# Altium schematic sheet power.SchDoc
size A4
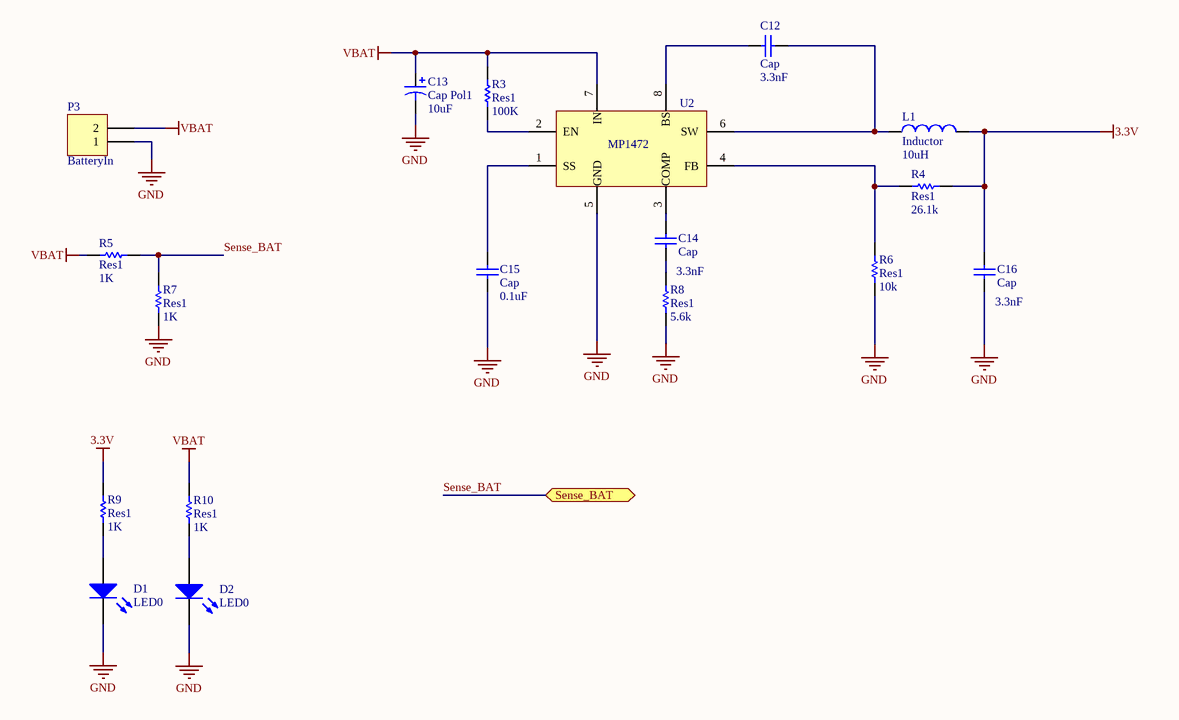
[diagram p0: power.SchDoc]

## Parts
C12  Cap  value 3.3nF  [0805-CAP]
C13  Cap Pol1  value 10uF  [Tantalum A-Case]
C14  Cap  value 3.3nF  [0805-CAP]
C15  Cap  value 0.1uF  [0805-CAP]
C16  Cap  value 3.3nF  [0805-CAP]
D1  LED0  [1206-LED RED]
D2  LED0  [1206-LED RED]
L1  Inductor  value 10uH  [DR125]
P3  BatteryIn  [Battery 1]
R3  Res1  value 100K  [0805-RES]
R4  Res1  value 26.1k  [0805-RES]
R5  Res1  value 1K  [0805-RES]
R6  Res1  value 10k  [0805-RES]
R7  Res1  value 1K  [0805-RES]
R8  Res1  value 5.6k  [0805-RES]
R9  Res1  value 1K  [0805-RES]
R10  Res1  value 1K  [0805-RES]
U2  MP1472  [TSOP-23]

## Ports
Sense_BAT

## Nets
3.3V: C16.1 L1.2 R4.2 R9.2
GND: C13.2 C15.2 C16.2 D1.2(K) D2.2(K) P3.1 R6.1 R7.2 R8.2 U2.5(GND)
VBAT: C13.1 P3.2 R3.1 R5.1 R10.2 U2.7(IN)
Sense_BAT: R5.2 R7.1 ; port Sense_BAT
NetC12_1: C12.1 U2.8(BS)
NetC12_2: C12.2 L1.1 U2.6(SW)
NetC14_1: C14.1 U2.3(COMP)
NetC14_2: C14.2 R8.1
NetC15_1: C15.1 U2.1(SS)
NetD1_1: D1.1(A) R9.1
NetD2_1: D2.1(A) R10.1
NetR3_2: R3.2 U2.2(EN)
NetR4_1: R4.1 R6.2 U2.4(FB)

## Library data of the parts
C12 C14-C16 = Cap: Capacitor; Published: 8-Jun-2000; LatestRevisionDate: 17-Jul-2002; LatestRevisionNote: Re-released for DXP Platform.; PackageReference: RAD-0.3; Publisher: Altium Limited; PackageDescription: Radial Cap, Thru-Hole; 2 Leads; 0.3 in Pin Spacing
C13 = Cap Pol1: Polarized Capacitor (Radial); Published: 8-Jun-2000; LatestRevisionDate: 17-Jul-2002; LatestRevisionNote: Re-released for DXP Platform.; PackageReference: RB7.6-15; Publisher: Altium Limited; PackageDescription: Polarized Capacitor (Radial); 2 Leads
D1 D2 = LED0: Typical INFRARED GaAs LED; Published: 8-Jun-2000; LatestRevisionDate: 08-Jul-2005; LatestRevisionNote: Mech Layer 1 removed.; PackageReference: LED-0; Publisher: Altium Limited; PackageDescription: LED; 2 Leads
L1 = Inductor: Code_IEC: 1005; Published: 8-Jun-2000; LatestRevisionDate: 29-May-2009; LatestRevisionNote: IPC-7351 Footprint Added.; PackageReference: 0402-A; Publisher: Altium Limited; PackageDescription: Chip Inductor; Code_JEITA: 0402
P3 = Header 2: Header, 2-Pin; LatestRevisionDate: 17-Jul-2002; LatestRevisionNote: Re-released for DXP Platform.; Publisher: Altium Limited
R3-R10 = Res1: Resistor; Published: 8-Jun-2000; LatestRevisionDate: 17-Jul-2002; LatestRevisionNote: Re-released for DXP Platform.; PackageReference: AXIAL-0.3; Publisher: Altium Limited; PackageDescription: Axial Device, Thru-Hole; 2 Leads; 0.3 in Pin Spacing
U2 = MP1472: MP1472 2A 18V Step-Down Conventor